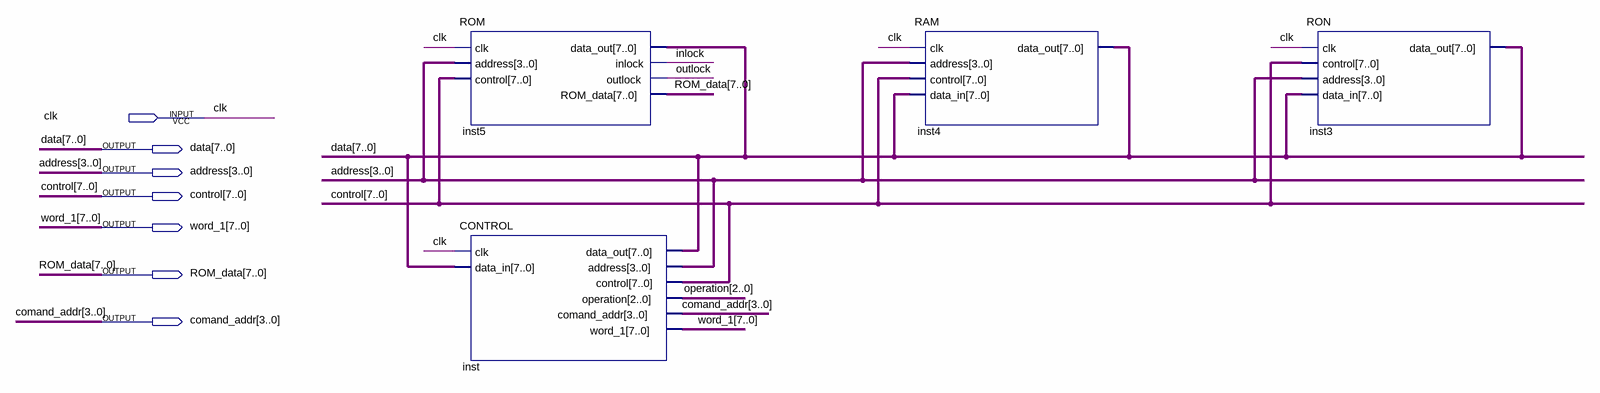
[diagram p0: schematic sheet]
// Quartus schematic MAIN.bdf as structural Verilog: 4 symbols, 7 pins
module MAIN (
  input  clk,
  output [7:0] data,
  output [3:0] address,
  output [7:0] control,
  output [7:0] word_1,
  output [7:0] ROM_data,
  output [3:0] comand_addr
);

  wire inlock, outlock;
  wire [2:0] operation;

  ROM inst5 (
    .clk(clk), .address(address), .control(control), .data_out(data), .inlock(inlock), .outlock(outlock),
    .ROM_data(ROM_data));
  CONTROL inst (
    .clk(clk), .data_in(data), .data_out(data), .address(address), .control(control), .operation(operation),
    .comand_addr(comand_addr), .word_1(word_1));
  RAM inst4 (.clk(clk), .address(address), .control(control), .data_in(data), .data_out(data));
  RON inst3 (.clk(clk), .control(control), .address(address), .data_in(data), .data_out(data));
endmodule
